# EAGLE schematic rel-clock (EAGLE 9.1.3)
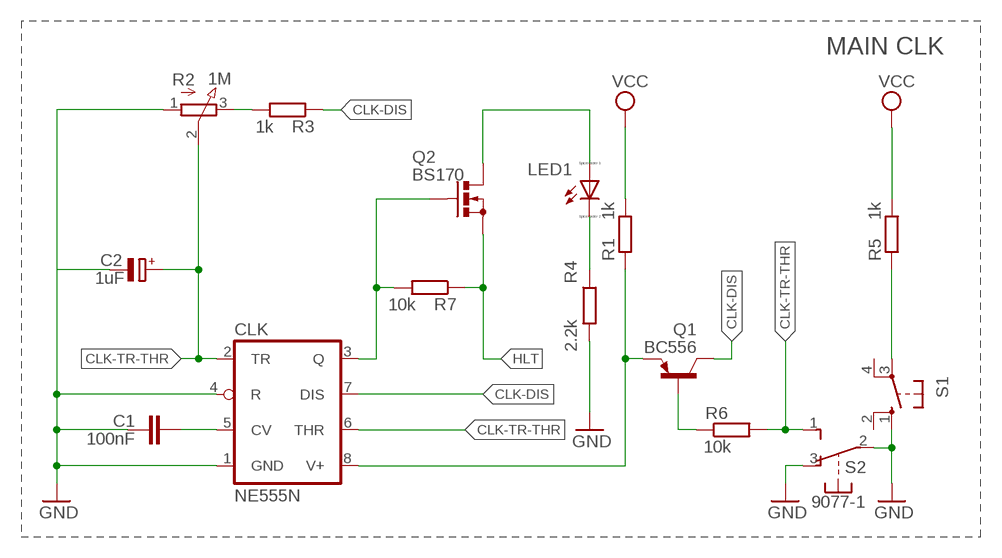
[diagram p0: schematic, sheet 1]

## Parts
C1  100nF  C-EU025-050X050  [C025-050X050]
C2  1uF  CPOL-EUE2-5  [E2-5]
CLK  NE555N  [DIL08]
LED1  LED_ELD260  [LED_LD260]
Q1  BC556  [TO92-EBC]
Q2  BS170  [SOT54E]
R1  1k  R-EU_0204/5  [0204/5]
R2  1M  3RP/1610N  [3RP/1610N]
R3  1k  R-EU_0204/5  [0204/5]
R4  2.2k  R-EU_0204/5  [0204/5]
R5  1k  R-EU_0204/5  [0204/5]
R6  10k  R-EU_0204/5  [0204/5]
R7  10k  R-EU_0204/5  [0204/5]
S1  10-XX  [B3F-10XX]
S2  9077-1  [9077-1]

## Nets
CLK-CV: C1.2 CLK.5(CV)
CLK-DIS: CLK.7(DIS) Q1.C R3.1
CLK-TR-THR: C2.+ CLK.2(TR) CLK.6(THR) Q1.B R2.2(S) R6.1 R6.2 S2.1(S)
GND: C1.1 C2.- CLK.1(GND) CLK.4(R) R2.1(A) R4.2 S1.1(S) S2.2(P) S2.3(O)
HLT: Q2.S R7.1
N$1: R5.1 S1.3(P)
N$2: R2.3(E) R3.2
N$3: CLK.8(V+) Q1.E R1.1
N$4: LED1.K(C) R4.1
N$6: LED1.A Q2.D
Q: CLK.3(Q) Q2.G R7.2
VCC: R1.2 R5.2
Unconnected: S1.2(S1) S1.4(P1)

## Notes on the sheet
- MAIN CLK

## Library data of the parts
C1 = resistor:C-EU: CAPACITOR, European symbol
C2 = rcl:CPOL-EU: POLARIZED CAPACITOR, European symbol; SPICEPREFIX: C
CLK = linear:*555: TIMER
LED1 = eagle-ltspice:LED_E: LED Source: http://www.osram.convergy.de Source: www.luxeon.com Source: www.kingbright.com; SPICEMODEL: NONE; SPICEPREFIX: D; SPICETYPE: diode
Q1 = transistor-pnp:BC556*: PNP Transistror
Q2 = transistor-small-signal:BS170: N-CHANNEL MOS FET
R1 R3-R7 = resistor:R-EU_: RESISTOR, European symbol
R2 = pot:3RP/1610N: 16mm Potentiometer one level Source: http://www.alphapotentiometers.net/html/16mm_pot_2.html
S1 = switch-omron:10-XX: OMRON SWITCH; MPN: B3F-1000; OC_FARNELL: 176432; OC_NEWARK: 36M3542
S2 = switch-misc:9077-1: MARQUARDT SWITCH 9077.0100 Distributor: Buerklin <https://www.buerklin.com/default.asp?event=ShowArtikel%2812G2820%29&l=d&jump=ArtNr_12G2820>